# Altium schematic sheet AccelPCB.SchDoc
size Letter; SheetNumber: 1; SheetTotal: 1
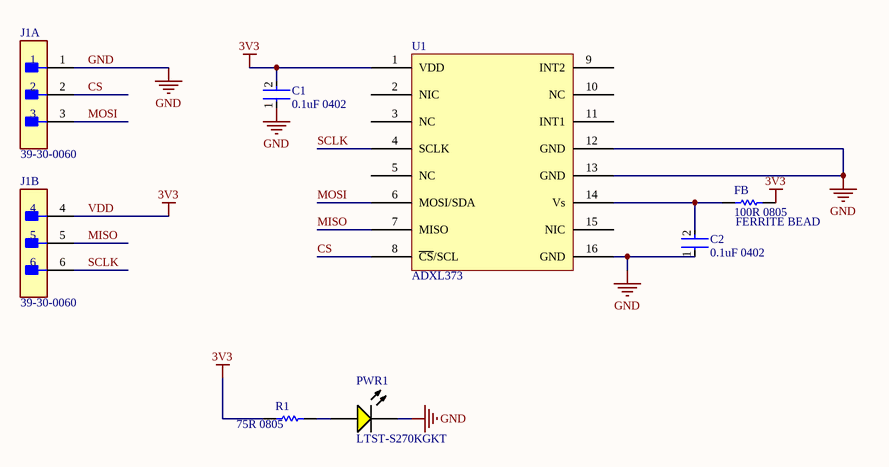
[diagram p0: AccelPCB.SchDoc]

## Parts
C1  0.1uF 0402  [FP-GRM15-MFG]
C2  0.1uF 0402  [FP-GRM15-MFG]
FB  100R 0805  [RESC2013X50X30LL20T20]
J1  39-30-0060  [FP-39-30-0060-MFG]  (parts A,B of 2)
PWR1  LTST-S270KGKT  [AVAG-HSMX-C190_V]
R1  75R 0805  [RESC2013X50X30LL20T20]
U1  ADXL373  [FP-CC-16-3-MFG]

## Nets
GND: C1.1 C2.1 J1.1 PWR1.2(K) U1.12(GND) U1.13(GND) U1.16(GND)
VDD: C1.2 FB.2 J1.4 R1.1 U1.1(VDD)  [also labelled 3V3]
CS: J1.2 U1.8(~{CS}/SCL)
MISO: J1.5 U1.7(MISO)
MOSI: J1.3 U1.6(MOSI/SDA)
SCLK: J1.6 U1.4(SCLK)
NetC2_2: C2.2 FB.1 U1.14(Vs)
NetPWR1_1: PWR1.1(A) R1.2

Not connected (* = marked no-connect by the designer): U1 2(NIC) 3(NC) 5(NC) 9(INT2) 10(NC) 11(INT1) 15(NIC)

## Notes on the sheet
- (near FB) FERRITE BEAD

## Library data of the parts
C1 C2 = CMP-2100-03641-2: CAP CER 0.1UF 16V X7R 0402; Manufacturer Part Number: GRM155R71C104KA88D; Manufacturer: Murata; Standoff Height: 0mm; Tolerance: 10%; Voltage Rating: 16Vdc; Material: Ceramic; Capacitance: 0.10μF; Value: 0.10μF; RoHS: TRUE; Temperature Characteristic: X7R; Octopart: https://octopart.com/grm155r71c104ka88d-murata-196880; Digikey Description: CAP CER 0.1UF 16V X7R 0402; Device Class L3: Ceramic Capacitors; Height: 0.55mm; ComponentLink2Description: Datasheet; Temperature Range Low: -55°C; Ipc Land Pattern Name: CAPC10050X219; ComponentLink2URL: https://search.murata.co.jp/Ceramy/image/img/A01X/G101/ENG/GRM155R71H471KA01-01A.pdf; Device Class L1: Passive Components; Lead Free: yes; Category: Cap; Package: GRM15; Temperature: -55°C to +125°C; Device Class L2: Capacitors; Temperature Range High: +125°C; Mouser Description: 0402 0.1 uF 16V ±10 % Tolerance X7R SMT Multilayer Ceramic Capacitor
FB R1 = CMP-2001-04896-1: Manufacturer: Vishay Dale; Part Number: CRCW08050000Z0EA
J1 = CMP-04776-000273-1: CONN HEADER R/A 6POS 4.2MM; Manufacturer Series: 5569; MIL Conformance: No; Mating Information: MULTIPLE MATING PARTS AVAILABLE; Number of Contacts: 6; Voltage Rating: 600V; Gender: Male; Insulation Resistance: 1GR; Option: General Purpose; Row Spacing: 0.165inch; Contact Resistance: 10mR; Current Rating: 13A; Glow Wire Compliant: Non-compliant; Number of Ports: 1; Flammability Rating: UL94 V-0; Number of Rows: 2; Series: Mini-Fit® Jr™ 5569; Housing Color: Natural; Filter Feature: No; Contact Gender: Male; Material: Nylon; Packaging: Bag; Radiation Hardening: No; Shell Material: POLYAMIDE66; Max Operating Temperature: 105°C; Voltage Rating (DC): 600V; Contact Type: Male Pin; Min Operating Temperature: -40°C; Contact Finish - Mating: TIN (200) OVER COPPER; DIN Conformance: No; Lead Free: Lead Free; Mixed Contacts: No; Empty Shell: No; Pitch: 4.2mm; Max Voltage Rating (AC): 600V; IEC Conformance: No; Termination: Solder; Contact Plating: Tin; Orientation: Right Angle; Halogen Free: Low Halogen; Number of Positions: 6; Housing Material: Polyamide; Depth: 19.4mm; Number of Circuits: 6; Fastening Type: Ramp; Contact Finish - Termination: TIN (200) OVER COPPER; ELV: Compliant; Mount: Through Hole; Contact Material: Brass
PWR1 = CMP-1744-00003-1: LED Uni-Color Yellow, 65 mW, 20 mA, -40 to 85 degC, 2-Pin SMD, RoHS, Tape and Reel; Tolerance: 1%; Voltage Rating: 50 V; Power Rating: 100 mW; Case\Package: 0603; Resistance: 390 Ohm; Min Operating Temperature: -55 degC; Length: 1.6 mm; ComponentLink3Description: Package Specification; Mount: Surface Mount; PackageReference: HSMX-C190; ComponentLink2Description: Datasheet; DatasheetVersion: Mar-12; Case Code (Metric): 1608; Pins: 2; Package Quantity: 5000; ComponentLink2URL: http://docs.avagotech.com/docs/AV02-0551EN; ComponentLink1Description: Manufacturer URL; RoHSCompliant: true; Packaging: Tape and Reel; PackageDescription: 2-Pin Surface Mount Device, Body 1.6 x 0.8 mm, Height 0.9 mm; REACH SVHC: No SVHC; ComponentLink3URL: http://www.fairchildsemi.com/dwg/MA/MA03D.pdf; Voltage Rating (DC): 50 V; Width: 0.8 mm; ComponentLink1URL: http://www.avagotech.com/; Max Operating Temperature: 155 degC; Case Code (Imperial): 0603; Height: 0.45 mm
U1 = Component_1